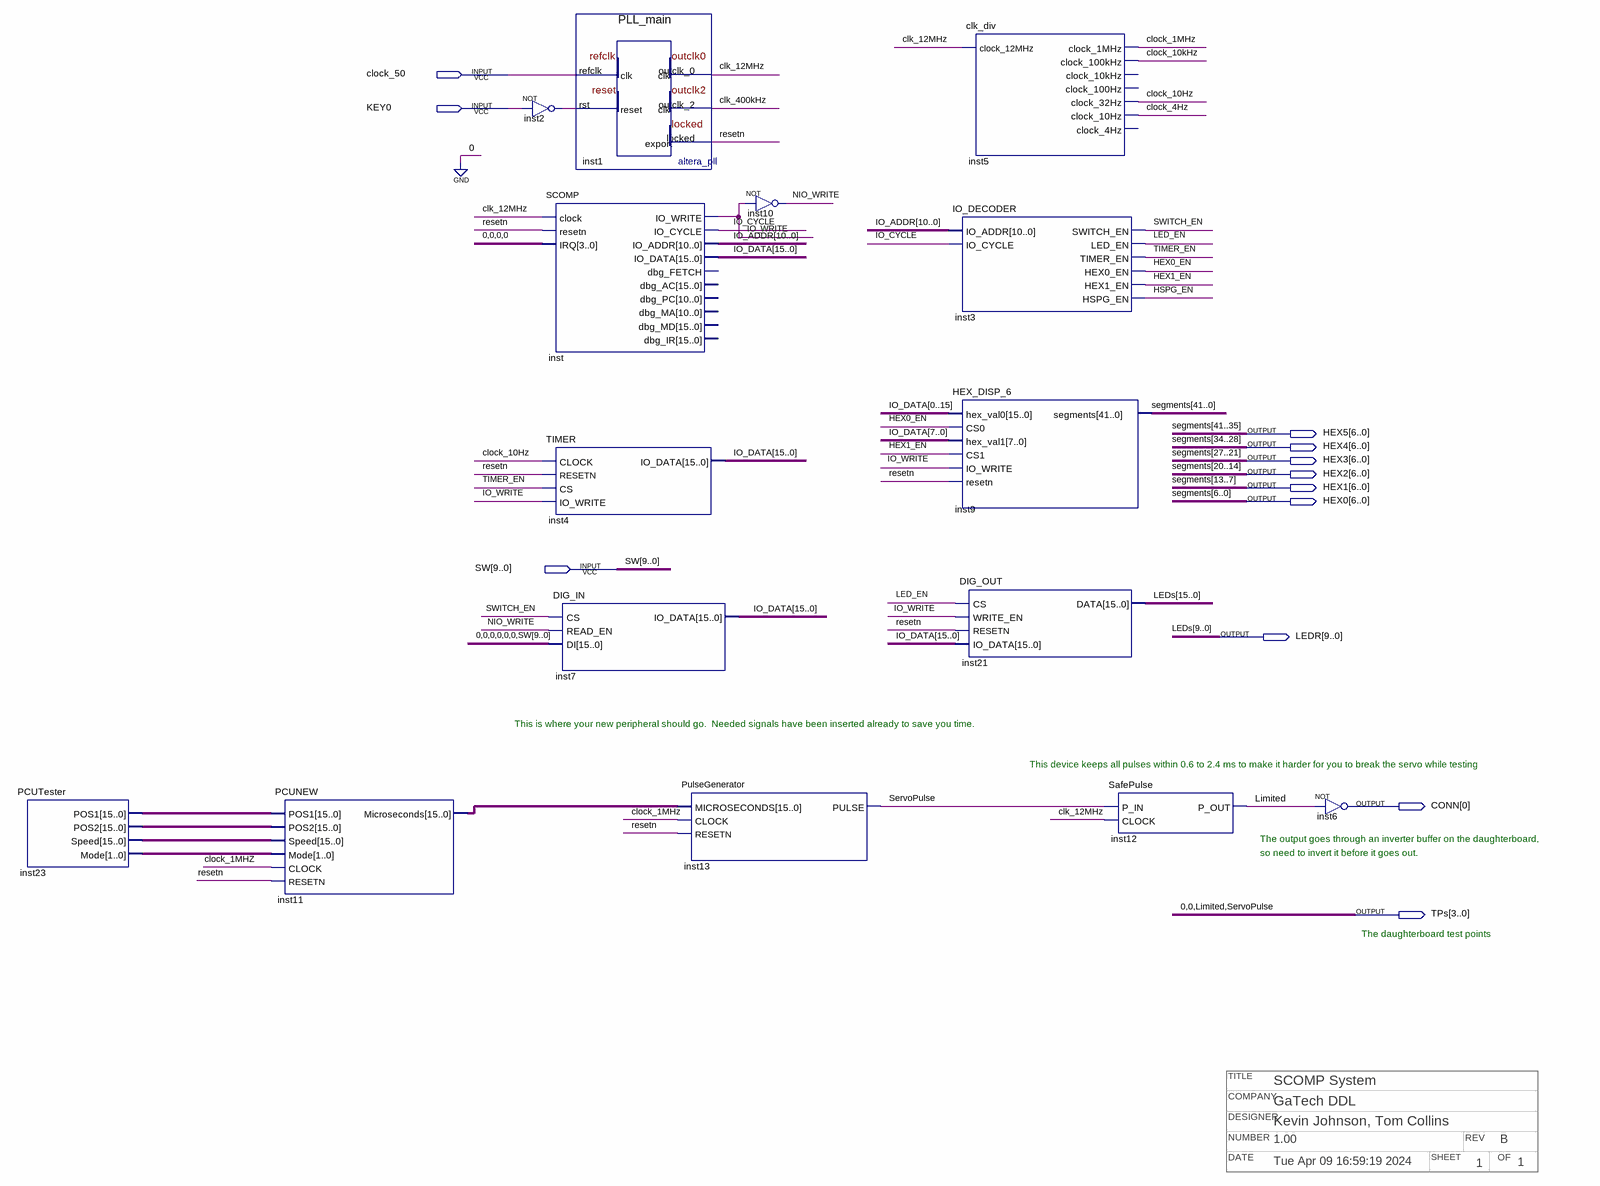
[diagram p0: schematic sheet]
// Quartus schematic SCOMP_System.bdf as structural Verilog: 15 symbols, 12 pins
// Title block: COMPANY: GaTech DDL; DATE: Tue Apr 09 16:59:19 2024; DESIGNER: Kevin Johnson, Tom Collins; NUMBER: 1.00; OF: 1; REV: B; SHEET: 1; TITLE: SCOMP System
module SCOMP_System (
  input  clock_50,
  input  KEY0,
  input  [9:0] SW,
  output [6:0] HEX5,
  output [6:0] HEX4,
  output [6:0] HEX3,
  output [6:0] HEX2,
  output [6:0] HEX1,
  output [6:0] HEX0,
  output [9:0] LEDR,
  output [0:0] CONN,
  output [3:0] TPs
);

  wire clk_12MHz, clk_400kHz, clock_1MHz, clock_4Hz, clock_10Hz, clock_10kHz, HEX0_EN, HEX1_EN, HSPG_EN,
       inst2_out, IO_CYCLE, IO_WRITE, LED_EN, NIO_WRITE, resetn, SWITCH_EN, TIMER_EN;
  wire [1:0] inst23_mode;
  wire [10:0] IO_ADDR;
  wire [15:0] inst11_microseconds, inst23_pos1, inst23_pos2, inst23_speed, IO_DATA;
  wire [15:10] LEDs;

  PCUTester inst23 (.POS1(inst23_pos1), .POS2(inst23_pos2), .Speed(inst23_speed), .Mode(inst23_mode));
  PCUNEW inst11 (
    .POS1(inst23_pos1), .POS2(inst23_pos2), .Speed(inst23_speed), .Mode(inst23_mode), .CLOCK(clock_1MHz),
    .RESETN(resetn), .Microseconds(inst11_microseconds));
  not inst2 (inst2_out, KEY0);
  SCOMP inst (
    .clock(clk_12MHz), .resetn(resetn), .IRQ(4'b0000), .IO_WRITE(IO_WRITE), .IO_CYCLE(IO_CYCLE),
    .IO_ADDR(IO_ADDR), .IO_DATA(IO_DATA));  // open: dbg_FETCH, dbg_AC, dbg_PC, dbg_MA, dbg_MD, dbg_IR
  TIMER inst4 (.CLOCK(clock_10Hz), .RESETN(resetn), .CS(TIMER_EN), .IO_WRITE(IO_WRITE), .IO_DATA(IO_DATA));
  DIG_IN inst7 (.CS(SWITCH_EN), .READ_EN(NIO_WRITE), .DI({{6{1'b0}}, SW}), .IO_DATA(IO_DATA));
  PLL_main inst1 (.refclk(clock_50), .rst(inst2_out), .outclk_0(clk_12MHz), .outclk_2(clk_400kHz), .locked(resetn));
  PulseGenerator inst13 (.MICROSECONDS(inst11_microseconds), .CLOCK(clock_1MHz), .RESETN(resetn), .PULSE(TPs[0]));
  not inst10 (NIO_WRITE, IO_WRITE);
  clk_div inst5 (
    .clock_12MHz(clk_12MHz), .clock_1MHz(clock_1MHz), .clock_100kHz(clock_10kHz), .clock_32Hz(clock_10Hz),
    .clock_10Hz(clock_4Hz));  // open: clock_10kHz, clock_100Hz, clock_4Hz
  IO_DECODER inst3 (
    .IO_ADDR(IO_ADDR), .IO_CYCLE(IO_CYCLE), .SWITCH_EN(SWITCH_EN), .LED_EN(LED_EN), .TIMER_EN(TIMER_EN),
    .HEX0_EN(HEX0_EN), .HEX1_EN(HEX1_EN), .HSPG_EN(HSPG_EN));
  HEX_DISP_6 inst9 (
    .hex_val0({IO_DATA[0], IO_DATA[1], IO_DATA[2], IO_DATA[3], IO_DATA[4], IO_DATA[5], IO_DATA[6], IO_DATA[7], IO_DATA[8], IO_DATA[9], IO_DATA[10], IO_DATA[11], IO_DATA[12], IO_DATA[13], IO_DATA[14], IO_DATA[15]}),
    .CS0(HEX0_EN), .hex_val1(IO_DATA[7:0]), .CS1(HEX1_EN), .IO_WRITE(IO_WRITE), .resetn(resetn),
    .segments({HEX5, HEX4, HEX3, HEX2, HEX1, HEX0}));
  DIG_OUT inst21 (.CS(LED_EN), .WRITE_EN(IO_WRITE), .RESETN(resetn), .IO_DATA(IO_DATA), .DATA({LEDs, LEDR}));
  SafePulse inst12 (.P_IN(TPs[0]), .CLOCK(clk_12MHz), .P_OUT(TPs[1]));
  not inst6 (CONN[0], TPs[1]);

  assign TPs[3:2] = 2'b00;

  // Other names for the same wires on the sheet: LEDs[9:0] = LEDR; Limited = TPs[1];
  //   segments[41:0] = {HEX5, HEX4, HEX3, HEX2, HEX1, HEX0}; ServoPulse = TPs[0]

  // Notes on the sheet:
  //   This is where your new peripheral should go.  Needed signals have been inserted already to save you time.
  //   This device keeps all pulses within 0.6 to 2.4 ms to make it harder for you to break the servo while testing
  //   The output goes through an inverter buffer on the daughterboard,
  //   so need to invert it before it goes out.
  //   The daughterboard test points
endmodule
